# Altium schematic sheet DC309A_CPLD.SchDoc: CPLD
size 558 x 431 mm; Date: Not shown in title block; ApprovedBy: Not shown in title block; CheckedBy: Not shown in title block; Author: Not shown in title block; CompanyName: Not shown in title block; DrawnBy: KAVIKANNAN; Engineer: Not shown in title block; Organization: Not shown in title block; Address1: Not shown in title block; Address2: Not shown in title block; Address3: Not shown in title block; Address4: Not shown in title block; DocumentNumber: 9; Revision: Use project parameter SCH_Rev; SheetNumber: 9; SheetTotal: 11; PageSetup: Record=PageOptions|CenterHorizontal=True|CenterVertical=True|PrintScale=1.00|XCorrection=1.00|YCorrection=1.00|PrintKind=0|BorderSize=5000000|LeftOffset=0|BottomOffset=0|Orientation=2|PaperLength=1000|PaperWidth=1000|Scale=100|PaperSource=15|PrintQuality=600|MediaType=1|DitherType=10|PaperKind=Letter|PrintScaleMode=1; CurrentTime: Not shown in title block; CurrentDate: Not shown in title block; Time: Not shown in title block; DocumentFullPathAndName: Not shown in title block; DocumentName: Not shown in title block; ModifiedDate: Not shown in title block; ImagePath: Not shown in title block
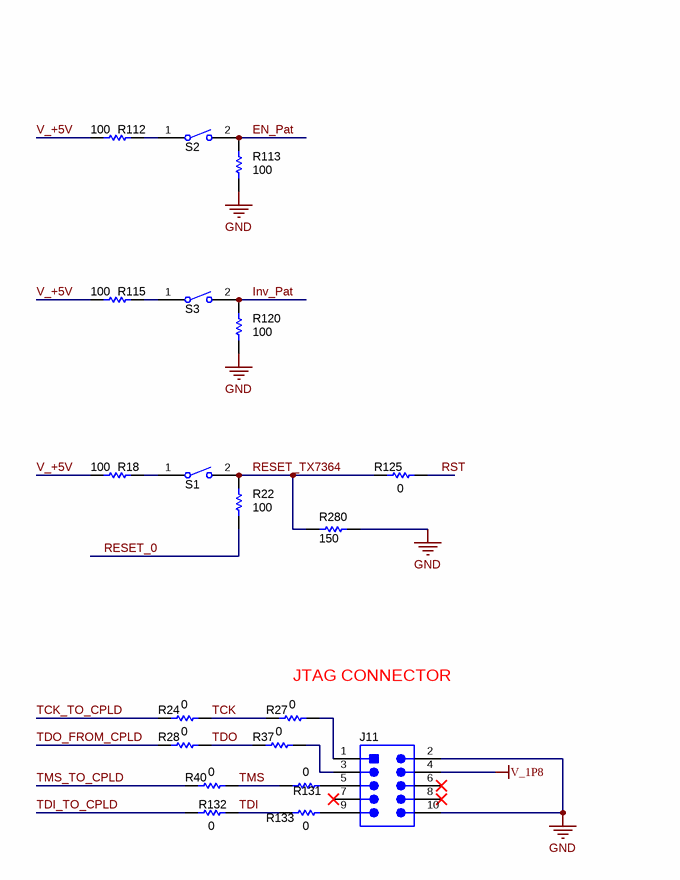
[diagram p0: DC309A_CPLD.SchDoc, top left]
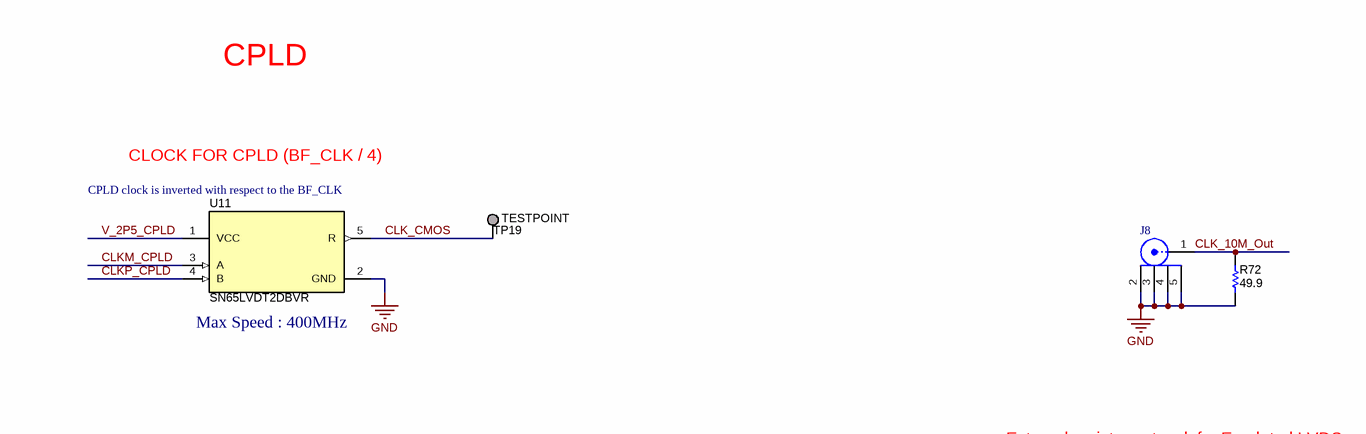
[diagram p1: DC309A_CPLD.SchDoc, top right]
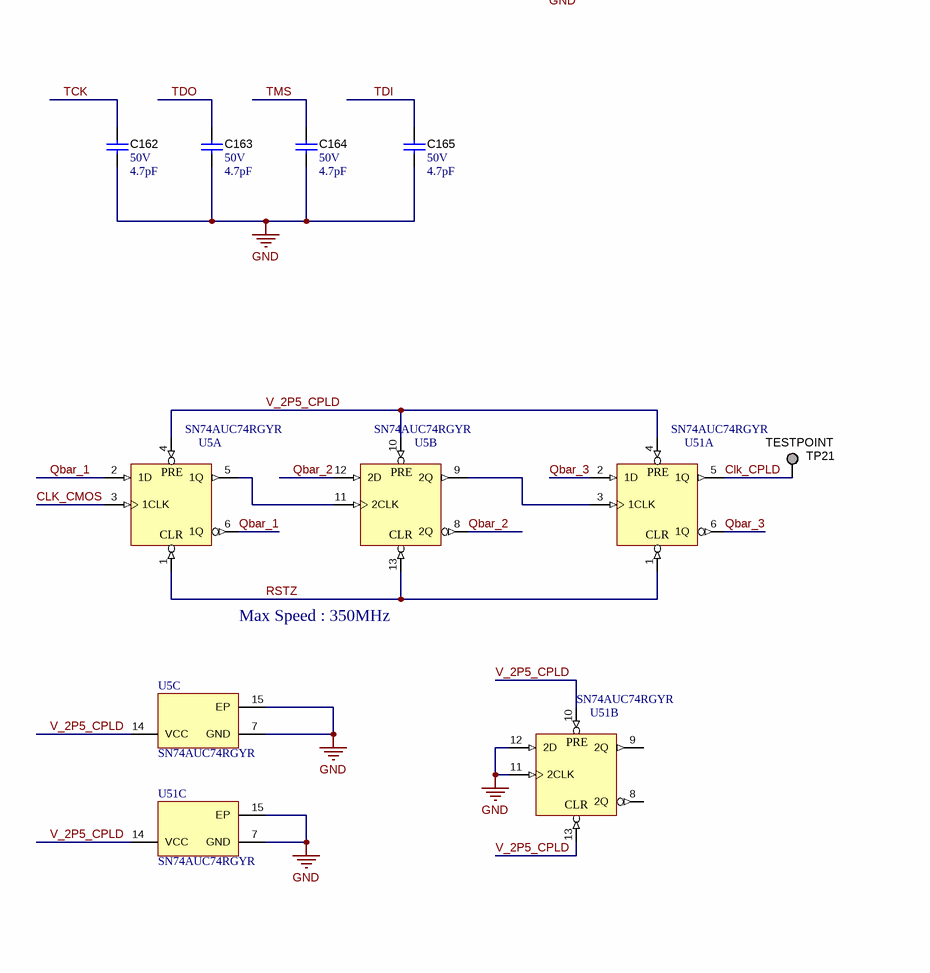
[diagram p2: DC309A_CPLD.SchDoc, bottom left]
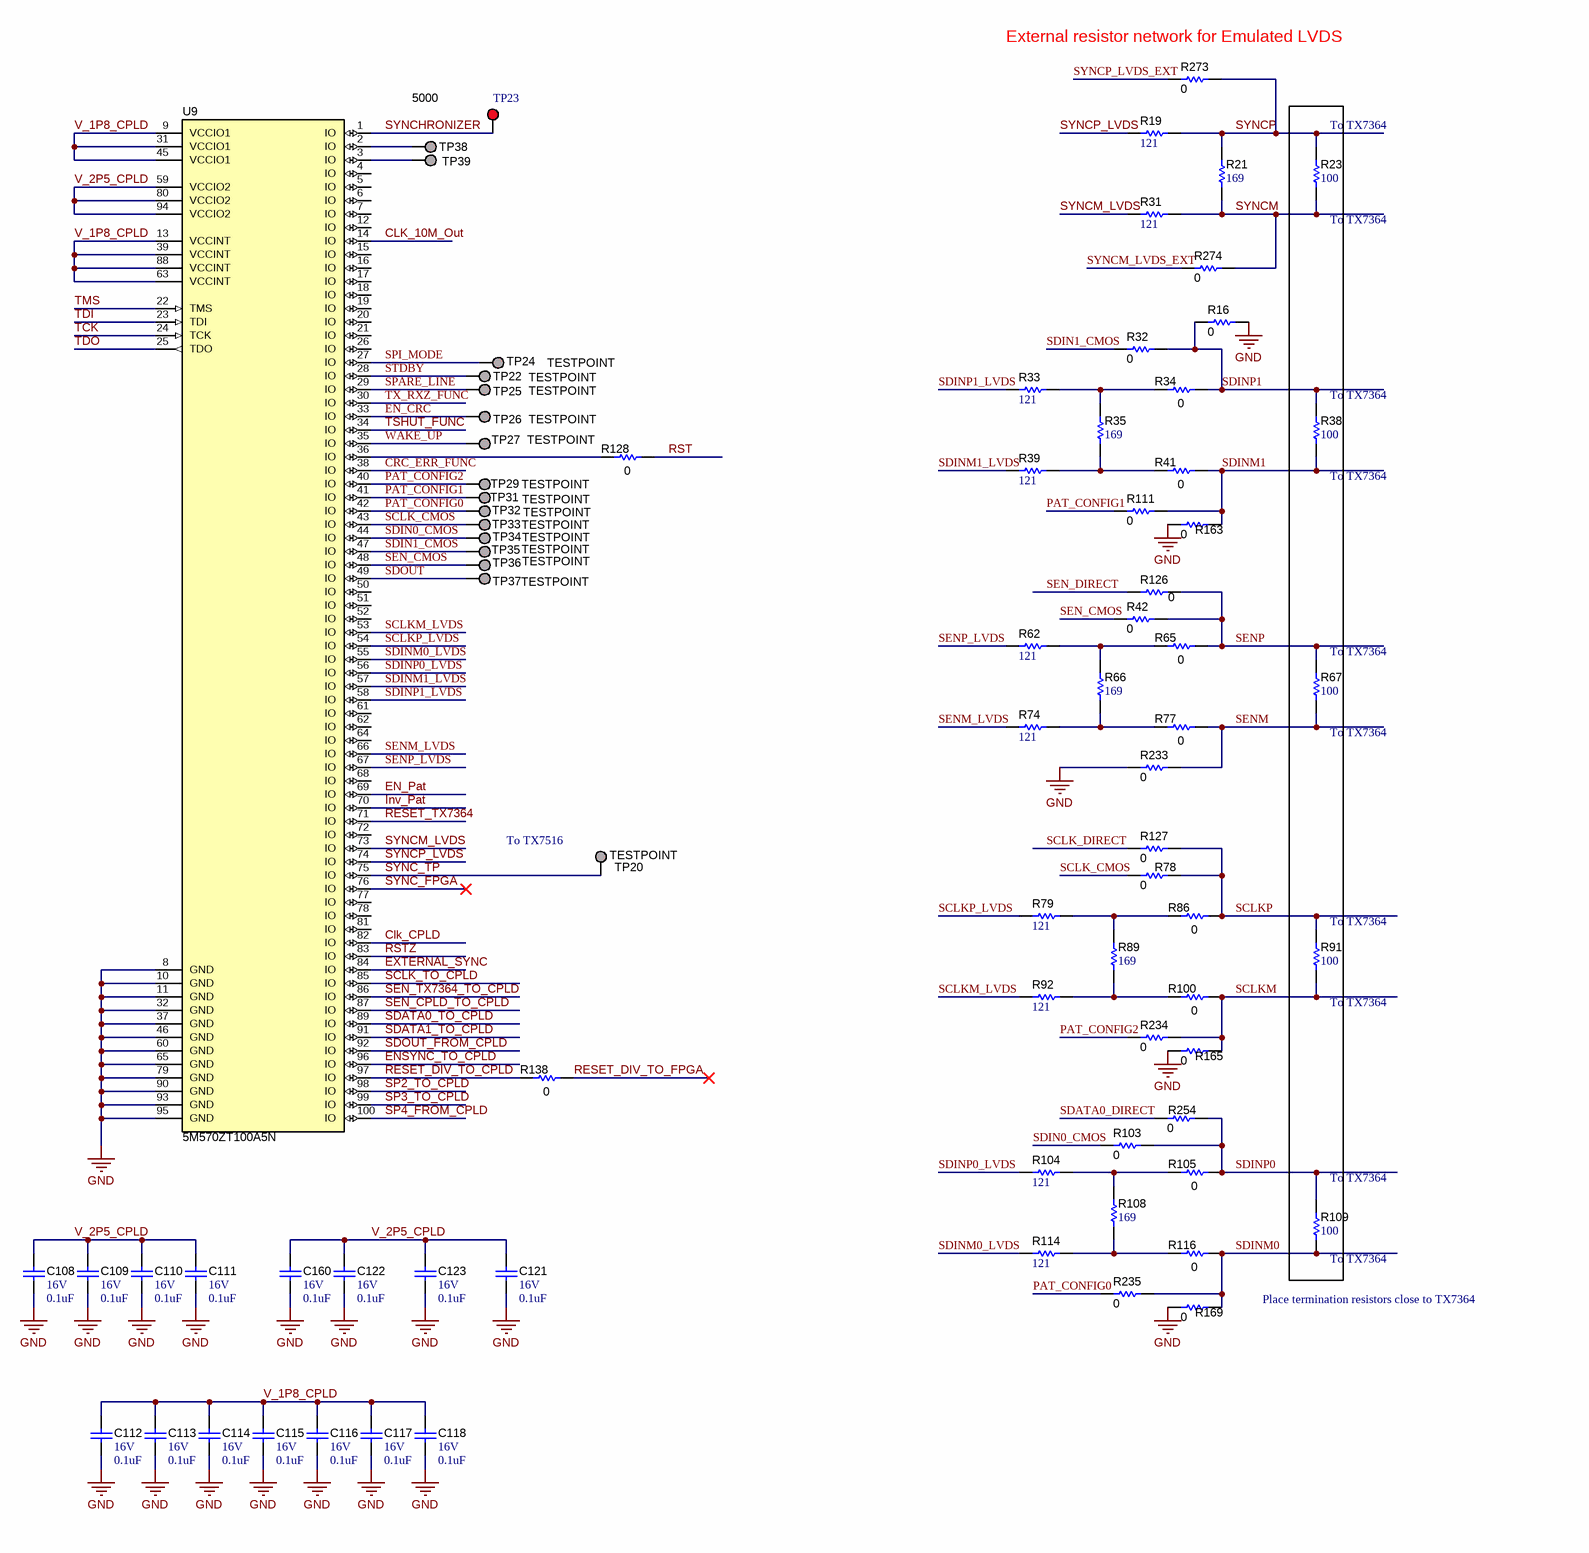
[diagram p3: DC309A_CPLD.SchDoc, bottom right]

## Parts
C108  VDC_V: 16V  ValueDisplayed: 0.1uF  [0402]  (hidden comment: 0402YC104KAT2A)
C109  VDC_V: 16V  ValueDisplayed: 0.1uF  [0402]  (hidden comment: 0402YC104KAT2A)
C110  VDC_V: 16V  ValueDisplayed: 0.1uF  [0402]  (hidden comment: 0402YC104KAT2A)
C111  VDC_V: 16V  ValueDisplayed: 0.1uF  [0402]  (hidden comment: 0402YC104KAT2A)
C112  VDC_V: 16V  ValueDisplayed: 0.1uF  [0402]  (hidden comment: 0402YC104KAT2A)
C113  VDC_V: 16V  ValueDisplayed: 0.1uF  [0402]  (hidden comment: 0402YC104KAT2A)
C114  VDC_V: 16V  ValueDisplayed: 0.1uF  [0402]  (hidden comment: 0402YC104KAT2A)
C115  VDC_V: 16V  ValueDisplayed: 0.1uF  [0402]  (hidden comment: 0402YC104KAT2A)
C116  VDC_V: 16V  ValueDisplayed: 0.1uF  [0402]  (hidden comment: 0402YC104KAT2A)
C117  VDC_V: 16V  ValueDisplayed: 0.1uF  [0402]  (hidden comment: 0402YC104KAT2A)
C118  VDC_V: 16V  ValueDisplayed: 0.1uF  [0402]  (hidden comment: 0402YC104KAT2A)
C121  VDC_V: 16V  ValueDisplayed: 0.1uF  [0402]  (hidden comment: 0402YC104KAT2A)
C122  VDC_V: 16V  ValueDisplayed: 0.1uF  [0402]  (hidden comment: 0402YC104KAT2A)
C123  VDC_V: 16V  ValueDisplayed: 0.1uF  [0402]  (hidden comment: 0402YC104KAT2A)
C160  VDC_V: 16V  ValueDisplayed: 0.1uF  [0402]  (hidden comment: 0402YC104KAT2A)
C162  VDC_V: 50V  ValueDisplayed: 4.7pF  [0603]  (hidden comment: 06035A4R7CAT2A)
C163  VDC_V: 50V  ValueDisplayed: 4.7pF  [0603]  (hidden comment: 06035A4R7CAT2A)
C164  VDC_V: 50V  ValueDisplayed: 4.7pF  [0603]  (hidden comment: 06035A4R7CAT2A)
C165  VDC_V: 50V  ValueDisplayed: 4.7pF  [0603]  (hidden comment: 06035A4R7CAT2A)
J8  901-144-8RFX  [AMPHENOL_901-144-8RFX]  (value not drawn)
J11  TSW-105-07-F-D  [Samtec_TSW-105-07-x-D]  (value not drawn)
R16  value 0  [0402]  (hidden comment: Resistor)
R18  Res_ohm: 100  [0402]  (hidden comment: Resistor)
R19  ValueDisplayed: 121  [0402]  (hidden comment: CRCW0402121RFKED)
R21  ValueDisplayed: 169  [0402]  (hidden comment: CRCW0402169RFKED)
R22  Res_ohm: 100  [0402]  (hidden comment: Resistor)
R23  ValueDisplayed: 100  [0402]  (hidden comment: CRCW0402100RFKED)
R24  value 0  [0402]  (hidden comment: Resistor)
R27  value 0  [0402]  (hidden comment: Resistor)
R28  value 0  [0402]  (hidden comment: Resistor)
R31  ValueDisplayed: 121  [0402]  (hidden comment: CRCW0402121RFKED)
R32  value 0  [0402]  (hidden comment: Resistor)
R33  ValueDisplayed: 121  [0402]  (hidden comment: CRCW0402121RFKED)
R34  value 0  [0402]  (hidden comment: Resistor)
R35  ValueDisplayed: 169  [0402]  (hidden comment: CRCW0402169RFKED)
R37  value 0  [0402]  (hidden comment: Resistor)
R38  ValueDisplayed: 100  [0402]  (hidden comment: CRCW0402100RFKED)
R39  ValueDisplayed: 121  [0402]  (hidden comment: CRCW0402121RFKED)
R40  value 0  [0402]  (hidden comment: Resistor)
R41  value 0  [0402]  (hidden comment: Resistor)
R42  value 0  [0402]  (hidden comment: Resistor)
R62  ValueDisplayed: 121  [0402]  (hidden comment: CRCW0402121RFKED)
R65  value 0  [0402]  (hidden comment: Resistor)
R66  ValueDisplayed: 169  [0402]  (hidden comment: CRCW0402169RFKED)
R67  ValueDisplayed: 100  [0402]  (hidden comment: CRCW0402100RFKED)
R72  ValueDisplayed: 49.9  [TNPW0603]  (hidden comment: TNPW060349R9BEEA)
R74  ValueDisplayed: 121  [0402]  (hidden comment: CRCW0402121RFKED)
R77  value 0  [0402]  (hidden comment: Resistor)
R78  value 0  [0402]  (hidden comment: Resistor)
R79  ValueDisplayed: 121  [0402]  (hidden comment: CRCW0402121RFKED)
R86  value 0  [0402]  (hidden comment: Resistor)
R89  ValueDisplayed: 169  [0402]  (hidden comment: CRCW0402169RFKED)
R91  ValueDisplayed: 100  [0402]  (hidden comment: CRCW0402100RFKED)
R92  ValueDisplayed: 121  [0402]  (hidden comment: CRCW0402121RFKED)
R100  value 0  [0402]  (hidden comment: Resistor)
R103  value 0  [0402]  (hidden comment: Resistor)
R104  ValueDisplayed: 121  [0402]  (hidden comment: CRCW0402121RFKED)
R105  value 0  [0402]  (hidden comment: Resistor)
R108  ValueDisplayed: 169  [0402]  (hidden comment: CRCW0402169RFKED)
R109  ValueDisplayed: 100  [0402]  (hidden comment: CRCW0402100RFKED)
R111  value 0  [0402]  (hidden comment: Resistor)
R112  Res_ohm: 100  [0402]  (hidden comment: Resistor)
R113  Res_ohm: 100  [0402]  (hidden comment: Resistor)
R114  ValueDisplayed: 121  [0402]  (hidden comment: CRCW0402121RFKED)
R115  Res_ohm: 100  [0402]  (hidden comment: Resistor)
R116  value 0  [0402]  (hidden comment: Resistor)
R120  Res_ohm: 100  [0402]  (hidden comment: Resistor)
R125  value 0  [0402]  (hidden comment: Resistor)
R126  value 0  [0402]  (hidden comment: Resistor)
R127  value 0  [0402]  (hidden comment: Resistor)
R128  value 0  [0402]  (hidden comment: Resistor)
R131  value 0  [0402]  (hidden comment: Resistor)
R132  value 0  [0402]  (hidden comment: Resistor)
R133  value 0  [0402]  (hidden comment: Resistor)
R138  value 0  [0402]  (hidden comment: Resistor)
R163  value 0  [0402]  (hidden comment: Resistor)
R165  value 0  [0402]  (hidden comment: Resistor)
R169  value 0  [0402]  (hidden comment: Resistor)
R233  value 0  [0402]  (hidden comment: Resistor)
R234  value 0  [0402]  (hidden comment: Resistor)
R235  value 0  [0402]  (hidden comment: Resistor)
R254  value 0  [0402]  (hidden comment: Resistor)
R273  value 0  [0402]  (hidden comment: Resistor)
R274  value 0  [0402]  (hidden comment: Resistor)
R280  ValueDisplayed: 150  [0603]  (hidden comment: RT0603BRD07150RL)
S1  SW_SPST-single  [SW_EVQ5PN04K]  (value not drawn)
S2  SW_SPST-single  [SW_EVQ5PN04K]  (value not drawn)
S3  SW_SPST-single  [SW_EVQ5PN04K]  (value not drawn)
TP19  TESTPOINT  [TP_50MIL-SMT]  (no BOM)
TP20  TESTPOINT  [TP_50MIL-SMT]  (no BOM)
TP21  TESTPOINT  [TP_50MIL-SMT]  (no BOM)
TP22  TESTPOINT  [TP_50MIL-SMT]  (no BOM)
TP23  5000  [Keystone5000]
TP24  TESTPOINT  [TP_50MIL-SMT]  (no BOM)
TP25  TESTPOINT  [TP_50MIL-SMT]  (no BOM)
TP26  TESTPOINT  [TP_50MIL-SMT]  (no BOM)
TP27  TESTPOINT  [TP_50MIL-SMT]  (no BOM)
TP29  TESTPOINT  [TP_50MIL-SMT]  (no BOM)
TP31  TESTPOINT  [TP_50MIL-SMT]  (no BOM)
TP32  TESTPOINT  [TP_50MIL-SMT]  (no BOM)
TP33  TESTPOINT  [TP_50MIL-SMT]  (no BOM)
TP34  TESTPOINT  [TP_50MIL-SMT]  (no BOM)
TP35  TESTPOINT  [TP_50MIL-SMT]  (no BOM)
TP36  TESTPOINT  [TP_50MIL-SMT]  (no BOM)
TP37  TESTPOINT  [TP_50MIL-SMT]  (no BOM)
TP38  TESTPOINT  [TP_50MIL-SMT]  (value not drawn)  (no BOM)
TP39  TESTPOINT  [TP_50MIL-SMT]  (value not drawn)  (no BOM)
U5  SN74AUC74RGYR  [RGY0014A]  (parts A,B,C of 3)
U9  5M570ZT100A5N  [TQFP100_14x14MM]
U11  SN65LVDT2DBVR  [DBV0005A_N]
U51  SN74AUC74RGYR  [RGY0014A]  (parts A,B,C of 3)

## Nets
GND: C108.2 C109.2 C110.2 C111.2 C112.2 C113.2 C114.2 C115.2 C116.2 C117.2 C118.2 C121.2 C122.2 C123.2 C160.2 C162.1 C163.1 C164.1 C165.1 J8.2 J8.3 J8.4 J8.5 J11.2 J11.10 R16.1 R72.1 R113.1 R120.1 R163.2 R165.2 R169.2 R233.2 R280.1 U5.7(GND) U5.15(EP) U9.8(GND) U9.10(GND) U9.11(GND) U9.32(GND) U9.37(GND) U9.46(GND) U9.60(GND) U9.65(GND) U9.79(GND) U9.90(GND) U9.93(GND) U9.95(GND) U11.2(GND) U51.7(GND) U51.11(2CLK) U51.12(2D) U51.15(EP)
V_1P8: J11.4
CLK_10M_Out: J8.1 R72.2 U9.14(IO)
CLK_CMOS: TP19.1 U5.3(1CLK) U11.5(R)
Clk_CPLD: TP21.1 U9.82(IO) U51.5(1Q)
CLKM_CPLD: U11.3(A)
CLKP_CPLD: U11.4(B)
CRC_ERR_FUNC: U9.38(IO)
EN_CRC: TP26.1 U9.33(IO)
EN_Pat: R113.2 S2.2 U9.69(IO)
ENSYNC_TO_CPLD: U9.96(IO)
EXTERNAL_SYNC: U9.84(IO)
Inv_Pat: R120.2 S3.2 U9.70(IO)
PAT_CONFIG0: R235.2 TP32.1 U9.42(IO)
PAT_CONFIG1: R111.2 TP31.1 U9.41(IO)
PAT_CONFIG2: R234.2 TP29.1 U9.40(IO)
Qbar_1: U5.2(1D) U5.6(1Q)
Qbar_2: U5.8(2Q) U5.12(2D)
Qbar_3: U51.2(1D) U51.6(1Q)
RESET_0: R22.1
RESET_DIV_TO_CPLD: R138.1 U9.97(IO)
RESET_DIV_TO_FPGA: R138.2
RESET_TX7364: R22.2 R125.1 R280.2 S1.2 U9.71(IO)
RST: R125.2 R128.2
RSTZ: U5.1(1~{CLR}) U5.13(2~{CLR}) U9.83(IO) U51.1(1~{CLR})
SCLK_CMOS: R78.2 TP33.1 U9.43(IO)
SCLK_DIRECT: R127.2
SCLK_TO_CPLD: U9.85(IO)
SCLKM: R91.1 R100.2 R165.1 R234.1
SCLKM_LVDS: R92.1 U9.53(IO)
SCLKP: R78.1 R86.2 R91.2 R127.1
SCLKP_LVDS: R79.1 U9.54(IO)
SDATA0_DIRECT: R254.2
SDATA0_TO_CPLD: U9.89(IO)
SDATA1_TO_CPLD: U9.91(IO)
SDIN0_CMOS: R103.2 TP34.1 U9.44(IO)
SDIN1_CMOS: R32.2 TP35.1 U9.47(IO)
SDINM0: R109.1 R116.2 R169.1 R235.1
SDINM0_LVDS: R114.1 U9.55(IO)
SDINM1: R38.1 R41.2 R111.1 R163.1
SDINM1_LVDS: R39.1 U9.57(IO)
SDINP0: R103.1 R105.2 R109.2 R254.1
SDINP0_LVDS: R104.1 U9.56(IO)
SDINP1: R16.2 R32.1 R34.2 R38.2
SDINP1_LVDS: R33.1 U9.58(IO)
SDOUT: TP37.1 U9.49(IO)
SDOUT_FROM_CPLD: U9.92(IO)
SEN_CMOS: R42.2 TP36.1 U9.48(IO)
SEN_CPLD_TO_CPLD: U9.87(IO)
SEN_DIRECT: R126.2
SEN_TX7364_TO_CPLD: U9.86(IO)
SENM: R67.1 R77.2 R233.1
SENM_LVDS: R74.1 U9.66(IO)
SENP: R42.1 R65.2 R67.2 R126.1
SENP_LVDS: R62.1 U9.67(IO)
SP2_TO_CPLD: U9.98(IO)
SP3_TO_CPLD: U9.99(IO)
SP4_FROM_CPLD: U9.100(IO)
SPARE_LINE: TP25.1 U9.29(IO)
SPI_MODE: TP24.1 U9.27(IO)
STDBY: TP22.1 U9.28(IO)
SYNC_FPGA: U9.76(IO)
SYNC_TP: TP20.1 U9.75(IO)
SYNCHRONIZER: TP23.1 U9.1(IO)
SYNCM: R21.1 R23.1 R31.2 R274.1
SYNCM_LVDS: R31.1 U9.73(IO)
SYNCM_LVDS_EXT: R274.2
SYNCP: R19.2 R21.2 R23.2 R273.1
SYNCP_LVDS: R19.1 U9.74(IO)
SYNCP_LVDS_EXT: R273.2
TCK: C162.2 R24.2 R27.1 U9.24(TCK)
TCK_TO_CPLD: R24.1
TDI: C165.2 R132.2 R133.1 U9.23(TDI)
TDI_TO_CPLD: R132.1
TDO: C163.2 R28.2 R37.1 U9.25(TDO)
TDO_FROM_CPLD: R28.1
TMS: C164.2 R40.2 R131.1 U9.22(TMS)
TMS_TO_CPLD: R40.1
TSHUT_FUNC: U9.34(IO)
TX_RXZ_FUNC: U9.30(IO)
V_1P8_CPLD: C112.1 C113.1 C114.1 C115.1 C116.1 C117.1 C118.1 U9.9(VCCIO1) U9.13(VCCINT) U9.31(VCCIO1) U9.39(VCCINT) U9.45(VCCIO1) U9.63(VCCINT) U9.88(VCCINT)
V_2P5_CPLD: C108.1 C109.1 C110.1 C111.1 C121.1 C122.1 C123.1 C160.1 U5.4(1~{PRE}) U5.10(2~{PRE}) U5.14(VCC) U9.59(VCCIO2) U9.80(VCCIO2) U9.94(VCCIO2) U11.1(VCC) U51.4(1~{PRE}) U51.10(2~{PRE}) U51.13(2~{CLR}) U51.14(VCC)
V_+5V: R18.1 R112.1 R115.1
WAKE_UP: TP27.1 U9.35(IO)
NetJ11_1: J11.1 R27.2
NetJ11_3: J11.3 R37.2
NetJ11_5: J11.5 R131.2
NetJ11_9: J11.9 R133.2
NetR18_2: R18.2 S1.1
NetR33_2: R33.2 R34.1 R35.2
NetR35_1: R35.1 R39.2 R41.1
NetR62_2: R62.2 R65.1 R66.2
NetR66_1: R66.1 R74.2 R77.1
NetR79_2: R79.2 R86.1 R89.2
NetR89_1: R89.1 R92.2 R100.1
NetR104_2: R104.2 R105.1 R108.2
NetR108_1: R108.1 R114.2 R116.1
NetR112_2: R112.2 S2.1
NetR115_2: R115.2 S3.1
NetR128_1: R128.1 U9.36(IO)
NetTP38_1: TP38.1 U9.2(IO)
NetTP39_1: TP39.1 U9.3(IO)
NetU5_5: U5.5(1Q) U5.11(2CLK)
NetU5_9: U5.9(2Q) U51.3(1CLK)

Not connected (* = marked no-connect by the designer): J11 6* 7* 8*; U9 4(IO) 5(IO) 6(IO) 7(IO) 12(IO) 15(IO) 16(IO) 17(IO) 18(IO) 19(IO) 20(IO) 21(IO) 26(IO) 50(IO) 51(IO) 52(IO) 61(IO) 62(IO) 64(IO) 68(IO) 72(IO) 77(IO) 78(IO) 81(IO); U51 8(2Q) 9(2Q)

## Notes on the sheet
- CPLD
- (near U11) CPLD clock is inverted with respect to the BF_CLK
- (near U11) CLOCK FOR CPLD (BF_CLK / 4)
- (near U11) Max Speed : 400MHz
- (near R273) External resistor network for Emulated LVDS
- (near R23) To TX7364
- (near R38) To TX7364
- (near R27) JTAG CONNECTOR
- (near R67) To TX7364
- (near TP20) To TX7516
- (near R91) To TX7364
- Max Speed : 350MHz
- (near R109) To TX7364
- Place termination resistors close to TX7364
- Drawn By:
- SVN Rev:
- Number:
- TID #:
- Orderable:
- Rev:
- Sheet Title:
- File:
- Project Title:
- Designed for:
- Assembly Variant:
- Mod. Date:
- Sheet:
- Size:
- of
- C
- http://www.ti.com
- Texas Instruments and/or its licensors do not warrant the accuracy or completeness of this specification or any information contained therein. Texas Instruments and/or its licensors do not warrant that this design will meet the specifications, will be suitable for your application or fit for any particular purpose, or will operate in an implementation. Texas Instruments and/or its licensors do not warrant that the design is production worthy. You should completely validate and test your design implementation to confirm the system functionality for your application.
- Engineer:
- Contact:
- © Texas Instruments
- (in symbol CMP-0048888-2, part A) PRE; CLR
- (in symbol CMP-0048888-2, part B) PRE; CLR

## Library data of the parts
C108-C118 C121-C123 C160 = CMP-0006201-2: CAP, CERM, 0.1 uF, 16 V, +/- 10%, X7R, 0402; Manufacturer: AVX; TaMin_C: -55°C; Polarized: N; SizeAreaWB_mm2: 3; Value1: Unknown; U/M: EA; Value: 0.1uF; TaMax_C: 125°C; SizeZ_mm: 0.6; SizeX_mm: 1; SizeY_mm: 0.5; Cap_F: 100nF; AEC Category: Q200; ComponentLink1URL: http://catalogs.avx.com/SurfaceMount.pdf; Supplier Part Number 2: 09R7024; Publisher: Texas Instruments; Supplier 2: Newark; Supplier Part Number 3: 581-0402YC104KAT2A; TempCo: X7R; Supplier 3: Mouser; Published: 2008-06-19; RoHS: Y; MountType: SMT; Supplier 1: Digi-Key; PackageReference: 0402; Tolerance_%: 10%; Cap_Case: 0402; Value2: 16V; SizeArea_mm2: 0.5; CompType: Capacitor; LatestRevisionDate: 2017-03-09; PartNumber: 0402YC104KAT2A; AEC Qualified: N; ComponentLink1Description: Datasheet link; AEC Grade: N/A; Supplier Part Number 1: 478-7888-1-ND; Technology: Ceramic
C162-C165 = CMP-0006791-4: CAP, CERM, 4.7 pF, 50 V, +/- 5%, C0G/NP0, 0603; Manufacturer: AVX; TaMin_C: -55°C; ESR_ohm: 0.633; Polarized: N; SizeAreaWB_mm2: 4.68; Value1: 0.633 ohm; U/M: EA; Value: 4.7pF; TaMax_C: 125°C; SizeZ_mm: 1; SizeX_mm: 1.6; SizeY_mm: 0.8; SizeArea_mm2: 1.28; AEC Category: Q200; Supplier Part Number 2: 581-06035A4R7C; Publisher: Texas Instruments; Supplier 2: Mouser; Supplier Part Number 3: 1833866; TempCo: C0G/NP0; Supplier 3: Farnell; Published: 2008-06-19; RoHS: Y; MountType: SMT; Supplier 1: Digi-Key; PackageReference: 0603; Tolerance_%: 5%; Cap_Case: 0603; Value2: 50V; CompType: Capacitor; LatestRevisionDate: 2017-03-09; PartNumber: 06035A4R7CAT2A; AEC Qualified: N; Cap_F: 4.7pF; ComponentLink1Description: Datasheet link; AEC Grade: N/A; Supplier Part Number 1: 478-1159-1-ND; Technology: Ceramic; ComponentLink1URL: http://datasheets.avx.com/C0GNP0-Dielectric.pdf
J8 = CMP-0055833-1: SMA Straight Jack, Gold, 50 Ohm, TH; Manufacturer: Amphenol RF; CNHeader: FALSE; Green_Lifecycle: Not Set; Green_REACh: Incomplete; CT: TRUE; ComponentLink1URL: http://www.amphenolinfocom.eu/NavData/Drawings/C901-144-8RFX.pdf; Supplier Part Number 2: 34C8151; Publisher: Texas Instruments; Supplier 2: Newark; Supplier Part Number 3: 523-901-144-8RFX; Supplier 3: Mouser; RoHS: Y; MountType: TH; Green_EU RoHS-2: Incomplete; Supplier 1: Digi-Key; Green_EU RoHS: Incomplete; PackageReference: SMA Straight Jack, TH; CompType: SMA; LatestRevisionDate: 26/05/2017; PartNumber: 901-144-8RFX; ComponentLink1Description: Datasheet URL; Supplier Part Number 1: ARFX1231-ND
J11 = CMP-0075665-2: Header, 2.54mm, 5x2, Gold, Black, TH; Manufacturer: Samtec; Pitch_mm: 2.54; Gender: Male; Cert_CSA: Y; Green_REACh: Passed; Shrouded: N; Green_Lifecycle: Active; Row_Count: 2; ComponentLink1Description: Datasheet URL; RoHS: Y; Supplier Part Number 3: 2025173; Supplier 1: Digi-Key; Cert_UL: Y; Orientation: Vertical; Green_EU RoHS: Passed; PackageReference: Header, 2.54mm, 5x2, TH; Color: Black; PartNumber: TSW-105-07-F-D; PinCount: 10; Supplier Part Number 2: 73P9489; ContactFinish: Gold; Supplier 2: Newark; ClassName: Header; RowSpacing_mm: 2.54; ComponentLink1URL: http://suddendocs.samtec.com/catalog_english/tsw_th.pdf; CompType: Header; MountType: TH; Supplier Part Number 1: SAM8999-ND; Supplier 3: Farnell; Green_EU RoHS-2: Passed
R16 R24 R27 R28 R32 R34 R37 R40-R42 R65 R77 R78 R86 R100 R103 R105 R111 R116 R125-R128 R131-R133 R138 R163 R165 R169 R233-R235 R254 R273 R274 = CMP-0026992-3: RES, 0, 5%, 0.1 W, AEC-Q200 Grade 0, 0402; PartNumber: ERJ-2GE0R00X; Manufacturer: Panasonic; Value_Code: 0000; Power_W: 100mW; Value2: 0.1W; VDC_V: 50V; TempCo: 600 ppm/C; SizeArea_mm2: 0.5; SizeX_mm: 1; SizeZ_mm: 0.6; EIA_Code: E24; AEC Category: Q200; AEC Qualified: Y; SizeAreaWB_mm2: 3; CompType: Resistor; PackageReference: 0402; RoHS: Y; Res_ohm: 0; Tolerance_%: 5%; Value1: 5%; MountType: SMT; Technology: Thick Film; SizeY_mm: 0.5; ComponentLink1Description: Datasheet link; ComponentLink1URL: https://industrial.panasonic.com/cdbs/www-data/pdf/RDA0000/AOA0000C301.pdf; Supplier 1: Digi-Key; Supplier Part Number 1: P0.0JCT-ND; Supplier 2: Newark; Supplier Part Number 2: 65T8307; Supplier 3: Mouser; Supplier Part Number 3: 667-ERJ-2GE0R00X; AEC Grade: 0; ValueDisplayed: 0
R18 R22 R112 R113 R115 R120 = CMP-0026824-3: RES, 100, 5%, 0.063 W, AEC-Q200 Grade 0, 0402; PartNumber: CRCW0402100RJNED; Manufacturer: Vishay-Dale; Value: 100; Value_Code: 100R; Power_W: 63mW; Value2: 0.063W; VDC_V: 50V; TempCo: 200 ppm/C; SizeArea_mm2: 0.5; SizeX_mm: 1; SizeZ_mm: 0.6; EIA_Code: E24; AEC Category: Q200; AEC Qualified: Y; AEC Grade: 0; CompType: Resistor; PackageReference: 0402; RoHS: E; Tolerance_%: 5%; Value1: 5%; MountType: SMT; Technology: Thick Film; SizeY_mm: 0.5; ComponentLink1Description: Datasheet link; ComponentLink1URL: http://www.vishay.com/docs/20035/dcrcwe3.pdf; Supplier 1: Digi-Key; Supplier Part Number 1: 541-100JCT-ND; Supplier 2: Newark; Supplier Part Number 2: 59M6700; Supplier 3: Mouser; Supplier Part Number 3: 71-CRCW0402J-100-E3; ValueDisplayed: 100
R19 R31 R33 R39 R62 R74 R79 R92 R104 R114 = CMP-0025985-3: RES, 121, 1%, 0.063 W, AEC-Q200 Grade 0, 0402; Manufacturer: Vishay-Dale; Power_W: 63mW; TempCo: 100 ppm/C; Value_Code: 121R; Value: 121; EIA_Code: E96; SizeX_mm: 1; SizeY_mm: 0.5; SizeZ_mm: 0.6; Value2: 0.063W; AEC Qualified: Y; VDC_V: 50V; AEC Category: Q200; AEC Grade: 0; Supplier Part Number 2: 52K6661; Supplier 2: Newark; Supplier Part Number 3: 71-CRCW0402-121-E3; Supplier 3: Mouser; RoHS: E; Value1: 1%; MountType: SMT; Supplier 1: Digi-Key; PackageReference: 0402; Tolerance_%: 1%; Res_ohm: 121; SizeArea_mm2: 0.5; CompType: Resistor; PartNumber: CRCW0402121RFKED; ComponentLink1Description: Datasheet link; Supplier Part Number 1: 541-121LCT-ND; Technology: Thick Film; ComponentLink1URL: http://www.vishay.com/docs/20035/dcrcwe3.pdf
R21 R35 R66 R89 R108 = CMP-0026039-3: RES, 169, 1%, 0.063 W, AEC-Q200 Grade 0, 0402; Manufacturer: Vishay-Dale; Power_W: 63mW; TempCo: 100 ppm/C; Value_Code: 169R; Value: 169; EIA_Code: E96; SizeX_mm: 1; SizeY_mm: 0.5; SizeZ_mm: 0.6; Value2: 0.063W; AEC Qualified: Y; VDC_V: 50V; AEC Category: Q200; AEC Grade: 0; Supplier Part Number 2: 72M6755; Supplier 2: Newark; Supplier Part Number 3: 71-CRCW0402-169-E3; Supplier 3: Mouser; RoHS: E; Value1: 1%; MountType: SMT; Supplier 1: Digi-Key; PackageReference: 0402; Tolerance_%: 1%; Res_ohm: 169; SizeArea_mm2: 0.5; CompType: Resistor; PartNumber: CRCW0402169RFKED; ComponentLink1Description: Datasheet link; Supplier Part Number 1: 541-169LCT-ND; Technology: Thick Film; ComponentLink1URL: http://www.vishay.com/docs/20035/dcrcwe3.pdf
R23 R38 R67 R91 R109 = CMP-0025951-3: RES, 100, 1%, 0.063 W, AEC-Q200 Grade 0, 0402; Manufacturer: Vishay-Dale; Power_W: 63mW; TempCo: 100 ppm/C; Value_Code: 100R; Value: 100; EIA_Code: E96; SizeX_mm: 1; SizeY_mm: 0.5; SizeZ_mm: 0.6; Value2: 0.063W; AEC Qualified: Y; VDC_V: 50V; AEC Category: Q200; AEC Grade: 0; Supplier Part Number 2: 52K6609; Supplier 2: Newark; Supplier Part Number 3: 71-CRCW0402-100-E3; Supplier 3: Mouser; RoHS: E; Value1: 1%; MountType: SMT; Supplier 1: Digi-Key; PackageReference: 0402; Tolerance_%: 1%; Res_ohm: 100; SizeArea_mm2: 0.5; CompType: Resistor; PartNumber: CRCW0402100RFKED; ComponentLink1Description: Datasheet link; Supplier Part Number 1: 541-100LCT-ND; Technology: Thick Film; ComponentLink1URL: http://www.vishay.com/docs/20035/dcrcwe3.pdf
R72 = CMP-0025693-1: RES, 49.9, 0.1%, 0.1 W, AEC-Q200 Grade 1, 0603; Manufacturer: Vishay-Dale; Power_W: 100mW; TempCo: 25 ppm/C; Value_Code: 49R9; U/M: EA; Value: 49.9; EIA_Code: E192; SizeX_mm: 1.6; SizeY_mm: 0.85; SizeZ_mm: 0.55; Value2: 0.1W; SizeArea_mm2: 1.36; AEC Qualified: Y; VDC_V: 75V; AEC Grade: 1; AEC Category: Q200; ComponentLink1URL: http://www.vishay.com/docs/28758/tnpw_e3.pdf; Supplier Part Number 2: 05R4782; Publisher: Texas Instruments; Supplier 2: Newark; Supplier Part Number 3: 71-TNPW060349R9BEEA; Supplier 3: Mouser; Published: 2008-06-26; RoHS: Y; Value1: 0.1%; MountType: SMT; Supplier 1: Digi-Key; PackageReference: 0603; Tolerance_%: 0.1%; Res_ohm: 49.9; CompType: Resistor; LatestRevisionDate: 2017-03-09; PartNumber: TNPW060349R9BEEA; ComponentLink1Description: Datasheet link; Supplier Part Number 1: 541-2031-1-ND; Technology: Thin Film
R280 = CMP-0023767-2: RES, 150, 0.1%, 0.1 W, 0603; Manufacturer: Yageo America; Power_W: 100mW; TempCo: 25 ppm/C; Value_Code: 150R; U/M: EA; Value: 150; EIA_Code: E192; SizeX_mm: 1.6; SizeY_mm: 0.8; SizeZ_mm: 1; Value2: 0.1W; SizeArea_mm2: 1.28; VDC_V: 75V; AEC Category: Q200; Publisher: Texas Instruments; Published: 2008-06-26; RoHS: Y; Value1: 0.1%; MountType: SMT; PackageReference: 0603; Tolerance_%: 0.1%; Res_ohm: 150; CompType: Resistor; LatestRevisionDate: 2017-03-09; PartNumber: RT0603BRD07150RL; AEC Qualified: ?; ComponentLink1Description: Datasheet link; Technology: Thin Film; ComponentLink1URL: http://www.yageo.com/pdf/PYu-RT_1-to-0.05_RoHS_L_3.pdf
S1-S3 = CMP-0002323-1: Switch, SPST-NO, Off-Mom, 0.05 A, 12 VDC, SMD; PartNumber: EVQ-5PN04K; Manufacturer: Panasonic; SizeAreaWB_mm2: 50.6; SizeArea_mm2: 25.2; SizeX_mm: 7.2; SizeY_mm: 3.5; SizeZ_mm: 4.3; VDC_V: 12V; PositionCount: 1; CurrentRating_mA: 50A; MountType: SMT; ComponentLink1Description: Datasheet URL; ComponentLink1URL: http://industrial.panasonic.com/cdbs/www-data/pdf/ATK0000/ATK0000CE7.pdf; RoHS: Y; Circuit: SPST-NO; SwitchFunction: Off-Mom; Orientation: Top Actuated; CompType: Switch; PackageReference: 6x3.5mm; Publisher: Texas Instruments; LatestRevisionDate: 2017-03-09; Supplier 1: Digi-Key; Supplier Part Number 1: P13595SCT-ND; Supplier 2: Newark; Supplier Part Number 2: 83T2844; Supplier 3: Mouser; Supplier Part Number 3: 667-EVQ-5PN04K
TP19-TP22 TP24-TP27 TP29 TP31-TP39 = CMP-0078143-3: TEST POINT.  No entry in BOM.; PackageReference: N/A; CompType: Testpoint; Manufacturer: N/A; PartNumber: N/A; Library Reference: TESTPOINT
TP23 = CMP-0055137-2: Test Point, Miniature, Red, TH; Manufacturer: Keystone Electronics; ContactFinish: Silver; CNHeader: FALSE; CT: TRUE; Green_Lifecycle: Active; Green_REACh: Passed; PackageReference: Red Miniature Testpoint; CompType: Test Point; Publisher: Texas Instruments; LatestRevisionDate: 26/05/2017; PartNumber: 5000; RoHS: Y; MountType: TH; ComponentLink1Description: Datasheet URL; ComponentLink1URL: http://www.keyelco.com/userAssets/file/M60-2p60.pdf; Color: Red; Supplier 1: Digi-Key; Supplier Part Number 1: 36-5000-ND; Supplier 2: Mouser; Supplier Part Number 2: 534-5000; Green_EU RoHS-2: Incomplete; Green_EU RoHS: Passed
U5 U51 = CMP-0048888-2: Dual Positive-Edge-Triggered D-Type Flip-Flops with Clear and Preset, RGY0014A, LARGE T&R; Manufacturer: Texas Instruments; Output Type: CMOS; Bits(#): 2; Technology Family: AUC; Schmitt Trigger: No; VCC(Max)(V): 2.7; Rating: Catalog; Output Drive (IOL/IOH)(Max)(mA): 9/-9; ICC @ Nom Voltage(Max)(mA): 0.01; VCC(Min)(V): 0.8; F @ Nom Voltage(Max)(Mhz): 250; Voltage(Nom)(V): 0.8,1.2,1.5,1.8,2.5; tpd @ Nom Voltage(Max)(ns): 9.5,4,2.5,2.1,1.4; Output Logic: Inverted,Non-inverted; Input Type: CMOS; Code_JEDEC: MO-241; 3-State Output: No; Operating Temperature Range(C): -40 to 85; PackageReference: RGY0014A; DatasheetVersion: SCES483A; Generic Part Number: SN74AUC74; PartNumber: SN74AUC74RGYR; PartId: 1
U9 = CMP-0083638-1: IC CPLD 440MC, TQFP-100; Manufacturer: Altera; SizeZ_mm: 1.2; SizeX_mm: 16; SizeArea_mm2: 256; SizeAreaWB_mm2: 324; ComponentLink1URL: https://www.altera.com/content/dam/altera-www/global/en_US/pdfs/literature/hb/max-v/mv51003.pdf; SizeY_mm: 16; Supplier Part Number 2: 989-5M570ZT100A5N; Supplier 1: Digi-Key; PackageReference: 14x14mm; RoHS: Y; Supplier Part Number 1: 544-3181-ND; PartNumber: 5M570ZT100A5N; MountType: SMT; ComponentLink1Description: Datasheet URL; Supplier 2: Mouser
U11 = CMP-0065800-1: Single LVDS Receiver, DBV0005A (SOT-23-5); Alternate PartNumber: SN65LVDT2DBVT; Alternate Manufacturer: Texas Instruments; SizeAreaWB_mm2: 14.82; U/M: EA; SizeZ_mm: 1.45; SizeX_mm: 2.8; SizeY_mm: 2.9; SizeArea_mm2: 8.12; CompType: IC; ComponentLink1URL: http://www.ti.com/lit/ds/symlink/sn65lvds1.pdf; Publisher: Texas Instruments; PackageDescription: SOT-23-5; RoHS: Y; Footprint Path 6: C:\AltiumLibraries\Footprints\TI\.PcbLib; MountType: SMT; Manufacturer: Texas Instruments; PackageReference: DBV0005A; LatestRevisionDate: 2017-06-09; PartNumber: SN65LVDT2DBVR; ComponentLink1Description: Datasheet Link